# EAGLE design bartoschslomak (EAGLE 9.6.2)
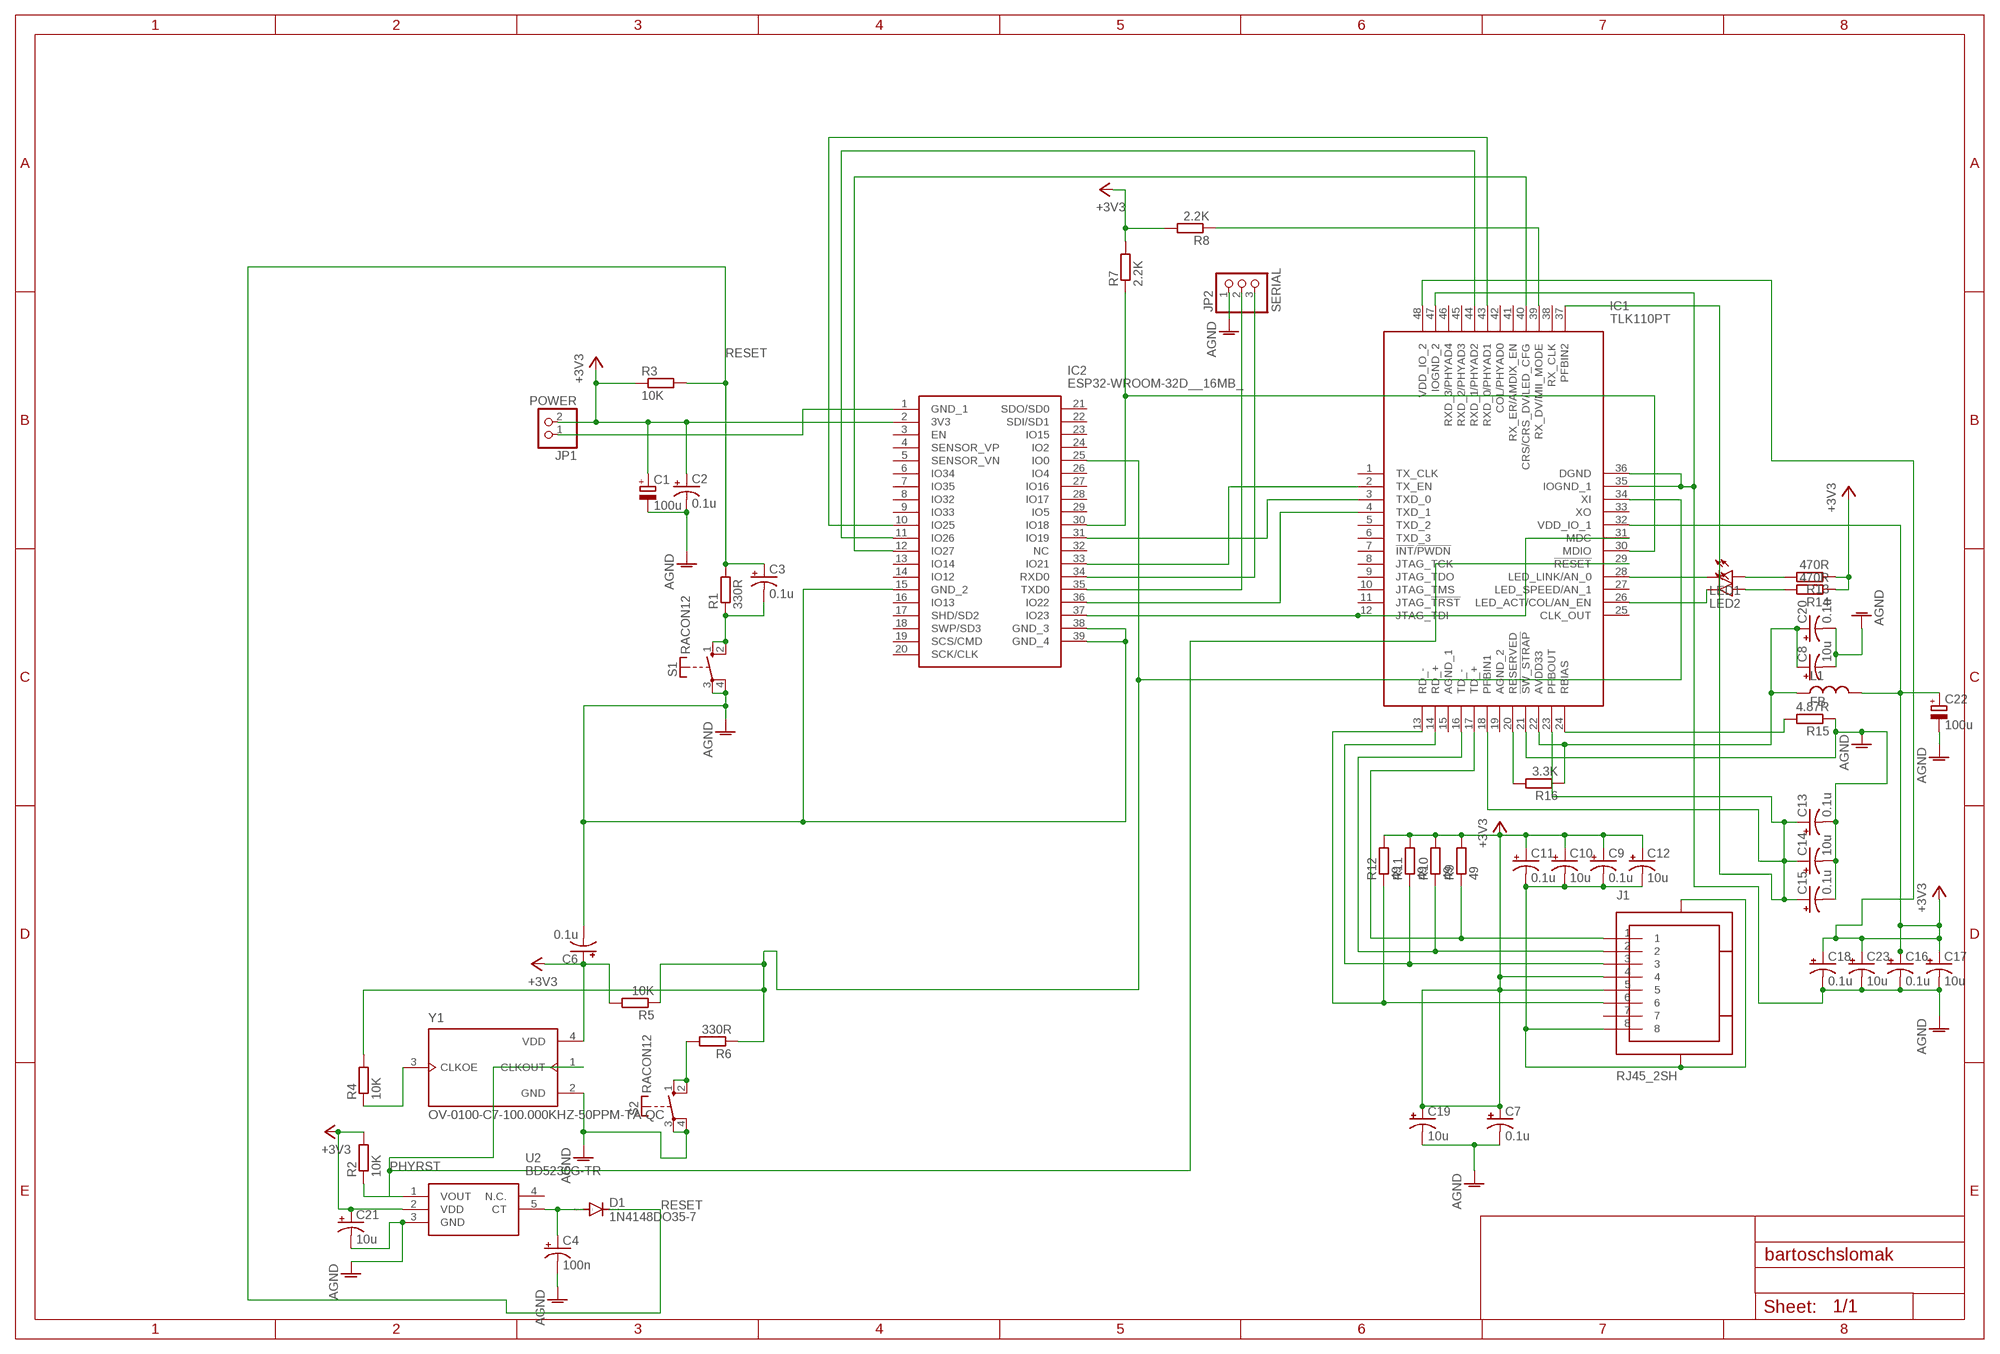
[diagram p0: schematic, sheet 1]

## Parts
C1  100u  CPOL-EUTT2D7  [TT2D7]
C2  0.1u  CPOL-USA/3216-18R  [A/3216-18R]
C3  0.1u  CPOL-USA/3216-18R  [A/3216-18R]
C4  100n  CPOL-USA/3216-18R  [A/3216-18R]
C6  0.1u  CPOL-USA/3216-18R  [A/3216-18R]
C7  0.1u  CPOL-USA/3216-18R  [A/3216-18R]
C8  10u  CPOL-USA/3216-18R  [A/3216-18R]
C9  0.1u  CPOL-USA/3216-18R  [A/3216-18R]
C10  10u  CPOL-USA/3216-18R  [A/3216-18R]
C11  0.1u  CPOL-USA/3216-18R  [A/3216-18R]
C12  10u  CPOL-USA/3216-18R  [A/3216-18R]
C13  0.1u  CPOL-USA/3216-18R  [A/3216-18R]
C14  10u  CPOL-USA/3216-18R  [A/3216-18R]
C15  0.1u  CPOL-USA/3216-18R  [A/3216-18R]
C16  0.1u  CPOL-USA/3216-18R  [A/3216-18R]
C17  10u  CPOL-USA/3216-18R  [A/3216-18R]
C18  0.1u  CPOL-USA/3216-18R  [A/3216-18R]
C19  10u  CPOL-USA/3216-18R  [A/3216-18R]
C20  0.1u  CPOL-USA/3216-18R  [A/3216-18R]
C21  10u  CPOL-USA/3216-18R  [A/3216-18R]
C22  100u  CPOL-EUTT2D7  [TT2D7]
C23  10u  CPOL-USA/3216-18R  [A/3216-18R]
D1  1N4148DO35-7  [DO35-7]
IC1  TLK110PT  [QFP50P900X900X160-48N]
IC2  ESP32-WROOM-32D__16MB_  [ESP32WROOM32D16MB]
J1  RJ45_2SH  [RJ45_LP_RA_SMT]
JP1  POWER  PINHD-1X2  [1X02]
JP2  SERIAL  PINHD-1X3  [1X03]
L1  FB  L  (no package)
LED1  LED  [SMARTLED-TTW]
LED2  LED  [SMARTLED-TTW]
R1  330R  R-EU_01005  [R01005]
R2  10K  R-EU_01005  [R01005]
R3  10K  R-EU_01005  [R01005]
R4  10K  R-EU_01005  [R01005]
R5  10K  R-EU_01005  [R01005]
R6  330R  R-EU_01005  [R01005]
R7  2.2K  R-EU_01005  [R01005]
R8  2.2K  R-EU_01005  [R01005]
R9  49  R-EU_01005  [R01005]
R10  49  R-EU_01005  [R01005]
R11  49  R-EU_01005  [R01005]
R12  49  R-EU_01005  [R01005]
R13  470R  R-EU_01005  [R01005]
R14  470R  R-EU_01005  [R01005]
R15  4.87R  R-EU_01005  [R01005]
R16  3.3K  R-EU_01005  [R01005]
S1  RACON12  [RACON12]
S2  RACON12  [RACON12]
U2  BD5230G-TR  [SOT95P280X125-5N]
Y1  OV-0100-C7-100.000KHZ-50PPM-TA-QC  [OSC_OV-0100-C7-100.000KHZ-50PPM-TA-QC]

## Nets
+3V1: C13.+ C14.+ C15.+ IC1.18(PFBIN1) IC1.23(PFBOUT) IC1.37(PFBIN2)
+3V3 [3V3]: C1.+ C2.+ C6.+ C7.+ C9.+ C10.+ C11.+ C12.+ C16.+ C17.+ C18.+ C19.+ C21.+ C22.+ C23.+ IC1.32(VDD_IO_1) IC1.48(VDD_IO_2) IC2.2(3V3) J1.4 J1.5 JP1.2 L1.2 R2.2 R3.1 R5.2 R7.2 R8.2 R9.2 R10.2 R11.2 R12.2 R13.1 R14.1 U2.2(VDD) Y1.4(VDD)
AGND [GND]: C1.- C2.- C4.- C6.- C7.- C8.- C13.- C14.- C15.- C16.- C17.- C18.- C19.- C20.- C21.- C22.- C23.- IC1.21(!SW_STRAP) IC1.35(IOGND_1) IC1.36(DGND) IC1.47(IOGND_2) IC2.15(GND_2) IC2.38(GND_3) IC2.39(GND_4) JP2.1 R15.1 S1.3(P) S1.4(P) S2.3(P) S2.4(P) U2.3(GND) Y1.2(GND)
N$2: IC2.1(GND_1) JP1.1
N$3: R4.1 Y1.3(CLKOE)
N$4: C3.- R1.1 S1.1(S) S1.2(S)
N$5: IC1.34(XI) IC2.25(IO0) R4.2 R5.1 R6.1
N$6: IC2.34(RXD0) JP2.3
N$7: R6.2 S2.1(S) S2.2(S)
N$8: IC2.35(TXD0) JP2.2
N$9: C4.+ D1.A U2.5(CT)
N$10: IC1.12(JTAG_TDI) IC1.31(MDC) IC2.37(IO23)
N$11: IC1.43(RXD_0/PHYAD1) IC2.10(IO25)
N$12: IC1.44(RXD_1/PHYAD2) IC2.11(IO26)
N$13: IC1.40(CRS/CRS_DV/LED_CFG) IC2.12(IO27)
N$14: IC1.4(TXD_1) IC2.36(IO22)
N$15: IC1.2(TX_EN) IC2.33(IO21)
N$16: IC1.3(TXD_0) IC2.31(IO19)
N$17: IC1.30(MDIO) IC2.30(IO18) R7.1
N$18: IC1.24(RBIAS) R15.2
N$19: IC1.39(RX_DV/MII_MODE) R8.1
N$20: C9.- C10.- C11.- C12.- J1.8 J1.S$1(SHIELD) J1.S$2(SHIELD)
N$21: IC1.20(RESERVED) R16.2
N$24: IC1.17(TD_+) J1.1 R9.1
N$25: IC1.16(TD_-) J1.2 R10.1
N$26: IC1.14(RD_+) J1.3 R11.1
N$27: IC1.13(RD_-) J1.6 R12.1
N$29: C8.+ C20.+ IC1.22(AVDD33) L1.1 R16.1
N$31: IC1.26(LED_ACT/COL/AN_EN) LED2.C@1(C)
N$32: IC1.28(LED_LINK/AN_0) LED1.C@1(C)
N$33: LED1.A@1(A) R13.2
N$34: LED2.A@1(A) R14.2
PHYRST: IC1.29(!RESET) R2.1 U2.1(VOUT) Y1.1(CLKOUT)
RESET: C3.+ D1.C R1.2 R3.2
Unconnected: IC1.1(TX_CLK) IC1.5(TXD_2) IC1.6(TXD_3) IC1.7(!INT!/!PWDN) IC1.8(JTAG_TCK) IC1.9(JTAG_TDO) IC1.10(JTAG_TMS) IC1.11(JTAG_!TRST) IC1.15(AGND_1) IC1.19(AGND_2) IC1.25(CLK_OUT) IC1.27(LED_SPEED/AN_1) IC1.33(XO) IC1.38(RX_CLK) IC1.41(RX_ER/AMDIX_EN) IC1.42(COL/PHYAD0) IC1.45(RXD_2/PHYAD3) IC1.46(RXD_3/PHYAD4) IC2.3(EN) IC2.4(SENSOR_VP) IC2.5(SENSOR_VN) IC2.6(IO34) IC2.7(IO35) IC2.8(IO32) IC2.9(IO33) IC2.13(IO14) IC2.14(IO12) IC2.16(IO13) IC2.17(SHD/SD2) IC2.18(SWP/SD3) IC2.19(SCS/CMD) IC2.20(SCK/CLK) IC2.21(SDO/SD0) IC2.22(SDI/SD1) IC2.23(IO15) IC2.24(IO2) IC2.26(IO4) IC2.27(IO16) IC2.28(IO17) IC2.29(IO5) IC2.32(NC) J1.7 U2.4(N.C.)

## Library data of the parts
C1 C22 = rcl:CPOL-EU: POLARIZED CAPACITOR, European symbol; SPICEPREFIX: C
C2-C4 C6-C21 C23 = rcl:CPOL-US: POLARIZED CAPACITOR, American symbol; SPICEPREFIX: C
D1 = diode:1N4148: DIODE high speed (Philips)
IC1 = TLK110PT:TLK110PT: Texas Instruments TLK110PT Ethernet Transceiver, IEEE 802.3u, 10 Mbit/s, 100 Mbit/s 3.3 V, 48-Pin LQFP Source: Datasheet <http://www.ti.com/lit/gpn/tlk110>; ARROW_PART_NUMBER: TLK110PT; ARROW_PRICE-STOCK: https://www.arrow.com/en/products/tlk110pt/texas-instruments; DESCRIPTION: Texas Instruments TLK110PT Ethernet Transceiver, IEEE 802.3u, 10 Mbit/s, 100 Mbit/s 3.3 V, 48-Pin LQFP; HEIGHT: 1.6mm; MANUFACTURER_NAME: Texas Instruments; MANUFACTURER_PART_NUMBER: TLK110PT; MOUSER_PART_NUMBER: 595-TLK110PT; MOUSER_PRICE-STOCK: https://www.mouser.com/Search/Refine.aspx?Keyword=595-TLK110PT
IC2 = ESP32-WROOM-32D__16MB_:ESP32-WROOM-32D__16MB_: WiFi Modules (802.11) SMD Module, ESP32-D0WD, 128Mbits SPI flash, UART mode, PCB antenna Source: Datasheet <https://www.espressif.com/sites/default/files/documentation/esp32-wroom-32d_esp32-wroom-32u_datasheet_en.pdf>; DESCRIPTION: WiFi Modules (802.11) SMD Module, ESP32-D0WD, 128Mbits SPI flash, UART mode, PCB antenna; HEIGHT: 3.2mm; MANUFACTURER_NAME: Espressif Systems; MANUFACTURER_PART_NUMBER: ESP32-WROOM-32D (16MB); MOUSER_PART_NUMBER: 356-ES32WROOM32D16MB
J1 = TL-WR703N:RJ45_2SH: RJ45 Socket with 2 Shield Pins Copyright © 2012, Michel Stempin, All rights reserved Licenced under Creative Commons CC BY-SA 3.0 <http://creativecommons.org/licenses/by-sa/3.0/deed.en> license.
JP1 = pinhead:PINHD-1X2: PIN HEADER
JP2 = pinhead:PINHD-1X3: PIN HEADER
L1 = ngspice-simulation:L: INDUCTOR
LED1 LED2 = led:LED: LED OSRAM: - CHIPLED LG R971, LG N971, LY N971, LG Q971, LY Q971, LO R971, LY R971 LH N974, LH R974 LS Q976, LO Q976, LY Q976 LO Q996 - Hyper CHIPLED LW Q18S LB Q993, LB Q99A, LB R99A - SideLED LS A670, LO A670, LY A670, LG A670, LP A670 LB A673, LV A673, LT A673, LW A673 LH A674 LY A675 LS A676, LA A676, LO A676, LY A676, LW A676 LS A679, LY A679, LG A679 - Hyper Micro SIDELED® LS Y876, LA Y876, LO Y876, LY Y876 LT Y87S - SmartLED LW L88C, LW L88S LB L89C, LB L89S, LG L890 LS L89K, LO L89K, LY L89K LS L896, LA L896, LO L896, LY L896 - TOPLED LS T670, LO T670, LY T670, LG T670, LP T670 LSG T670, LSP T670, LSY T670, LOP T670, LYG T670 LG T671, LOG T671, LSG T671 LB T673, LV T673, LT T673, LW T673 LH T674 LS T676, LA T676, LO T676, LY T676, LB T676, LH T676, LSB T676, LW T676 LB T67C, LV T67C, LT T67C, LS T67K, LO T67K, LY T67K, LW E67C LS E67B, LA E67B, LO E67B, LY E67B, LB E67C, LV E67C, LT E67C LW T67C LS T679, LY T679, LG T679 LS T770, LO T770, LY T770, LG T770, LP T770 LB T773, LV T773, LT T773, LW T773 LH T774 LS E675, LA E675, LY E675, LS T675 LS T776, LA T776, LO T776, LY T776, LB T776 LHGB T686 LT T68C, LB T68C - Hyper Mini TOPLED® LB M676 - Mini TOPLED Santana® LG M470 LS M47K, LO M47K, LY M47K Source: http://www.osram.convergy.de LUXEON: - LUMILED® LXK2-PW12-R00, LXK2-PW12-S00, LXK2-PW14-U00, LXK2-PW14-V00 LXK2-PM12-R00, LXK2-PM12-S00, LXK2-PM14-U00 LXK2-PE12-Q00, LXK2-PE12-R00, LXK2-PE12-S00, LXK2-PE14-T00, LXK2-PE14-U00 LXK2-PB12-K00, LXK2-PB12-L00, LXK2-PB12-M00, LXK2-PB14-N00, LXK2-PB14-P00, LXK2-PB14-Q00 LXK2-PR12-L00, LXK2-PR12-M00, LXK2-PR14-Q00, LXK2-PR14-R00 LXK2-PD12-Q00, LXK2-PD12-R00, LXK2-PD12-S00 LXK2-PH12-R00, LXK2-PH12-S00 LXK2-PL12-P00, LXK2-PL12-Q00, LXK2-PL12-R00 Source: www.luxeon.com KINGBRIGHT: KA-3528ASYC Source: www.kingbright.com
R1-R16 = rcl:R-EU_: RESISTOR, European symbol; SPICEPREFIX: R
S1 S2 = switch-misc:RACON12: ITT SWITCH
U2 = BD5230G-TR:BD5230G-TR: ROHM BD5230G-TR, Voltage Detector, 2.3 6 V 5-Pin, SSOP Source: Datasheet <http://rohmfs.rohm.com/en/products/databook/datasheet/ic/power/voltage_detector/bd52xxg-e.pdf>; DESCRIPTION: ROHM BD5230G-TR, Voltage Detector, 2.3 6 V 5-Pin, SSOP; HEIGHT: 1.25mm; MANUFACTURER_NAME: ROHM Semiconductor; MANUFACTURER_PART_NUMBER: BD5230G-TR; MOUSER_PART_NUMBER: 755-BD5230G-TR; MOUSER_PRICE-STOCK: https://www.mouser.co.uk/ProductDetail/ROHM-Semiconductor/BD5230G-TR?qs=4kLU8WoGk0s1B3xxWJut5A%3D%3D
Y1 = OV-0100-C7-100.000KHZ-50PPM-TA-QC:OV-0100-C7-100.000KHZ-50PPM-TA-QC: OV-0100-C7-32.768KHZ-20PPM-TB-QC Low Power Clock Oscillator 100.000 kHz Check availability <https://pricing.snapeda.com/parts/OV-0100-C7-100.000KHZ-50PPM-TA-QC/Micro%20Crystal/view-part?ref=eda>; AVAILABILITY: In Stock; CHECK_PRICES: https://www.snapeda.com/parts/OV-0100-C7-100.000KHZ-50PPM-TA-QC/Micro+Crystal/view-part/?ref=eda; DESCRIPTION: 100 kHz XO (Standard) CMOS Oscillator 3V Enable/Disable 4-SMD, No Lead; MF: Micro Crystal; MP: OV-0100-C7-100.000KHZ-50PPM-TA-QC; PACKAGE: QFN-4 Micro Crystal; PRICE: None; PURCHASE-URL: https://www.snapeda.com/api/url_track_click_mouser/?unipart_id=13796273&manufacturer=Micro Crystal&part_name=OV-0100-C7-100.000KHZ-50PPM-TA-QC&search_term=kc7050a; SNAPEDA_LINK: https://www.snapeda.com/parts/OV-0100-C7-100.000KHZ-50PPM-TA-QC/Micro+Crystal/view-part/?ref=snap

## Net classes
0 default: width 0.127 mm, drill 0.127 mm, clearance 0.127 mm
1 RESET: width 0.127 mm, drill 0.127 mm, clearance 0.127 mm
2 3V3: width 0.203 mm, drill 0.127 mm, clearance 0.127 mm
3 GND: width 0.127 mm, drill 0.127 mm, clearance 0.127 mm

## Board
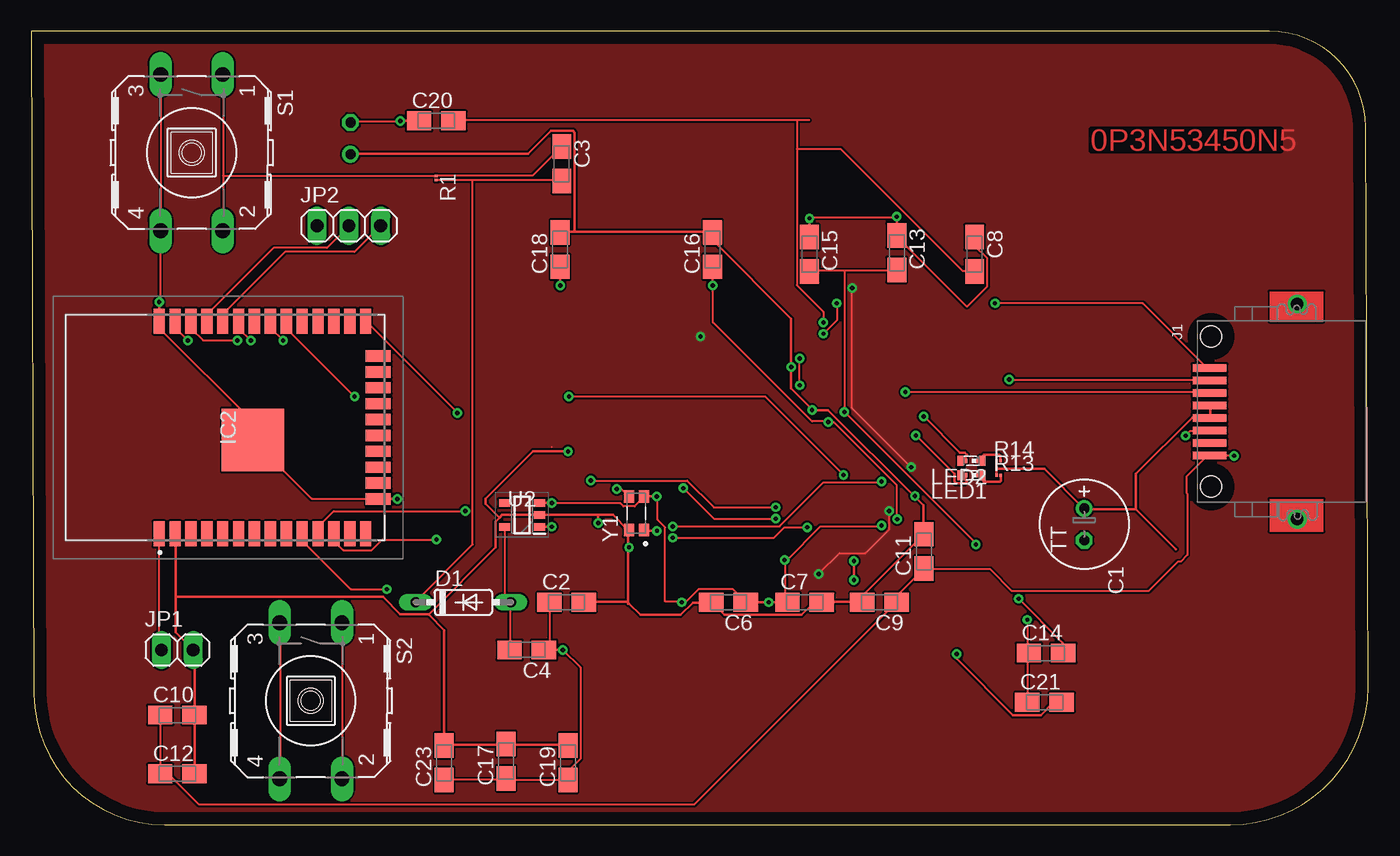
[diagram p1: board, top side]
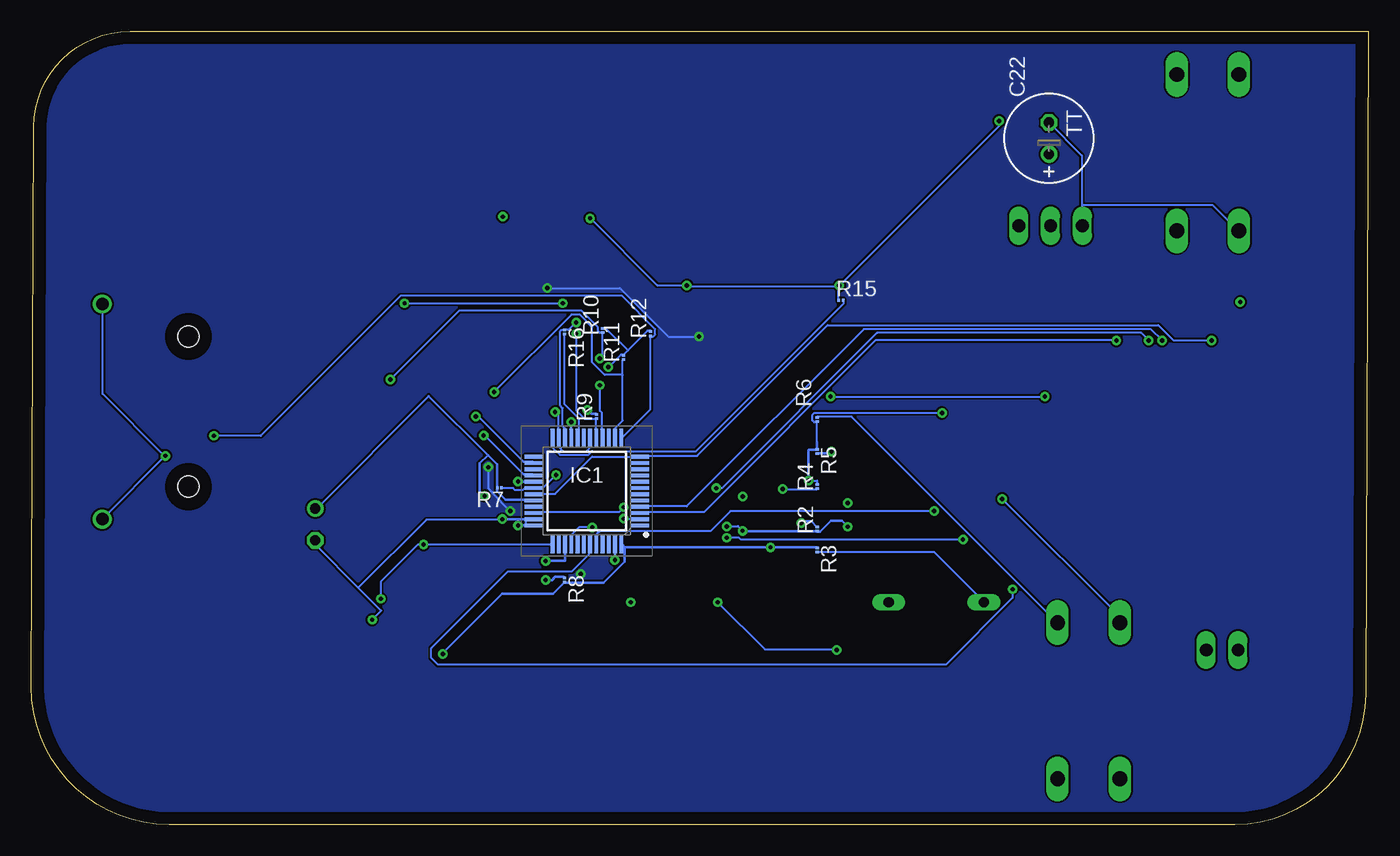
[diagram p2: board, bottom side, seen from below]

Size 106.91 x 63.42 mm. Coordinates in mm from the lower left corner, seen from the top.
Outline: 0,63.42 0.21,10.42 arc90 10.67,0 95.89,0 arc90 106.91,11.02 106.7,55.78 arc90 99.02,63.42 0,63.42
Copper layers (1*16): Top 0.035mm / dielectric 1.5mm / Bottom 0.035mm
Design rules "default": minimum track width 6mil, minimum drill 0.35mm, track to track 6mil, track to pad 6mil, pad to pad 6mil, via to via 6mil, smd to smd 6mil, copper to edge 40mil, drill to drill 6mil, minimum pad ring 10mil, minimum via ring 8mil, stop-mask expansion 4mil, vias tented up to drill 0mil, thermal gap 10mil

### Footprints (pad centres in the part's own frame; a part is rotated, then mirrored left to right if it is on the bottom)
TT2D7 = drill 0.813: + -1.27,0 | drill 0.813 octagon: - 1.27,0
A/3216-18R = smd 1.95 x 1.5: + 1.375,0; - -1.375,0
DO35-7 = drill 0.813 long: A 3.81,0; C -3.81,0
QFP50P900X900X160-48N = smd 1.475 x 0.3: 1 -4.238,2.75; 2 -4.238,2.25; 3 -4.238,1.75; 4 -4.238,1.25; 5 -4.238,0.75; 6 -4.238,0.25; 7 -4.238,-0.25; 8 -4.238,-0.75; 9 -4.238,-1.25; 10 -4.238,-1.75; 11 -4.238,-2.25; 12 -4.238,-2.75; 25 4.238,-2.75; 26 4.238,-2.25; 27 4.238,-1.75; 28 4.238,-1.25; 29 4.238,-0.75; 30 4.238,-0.25; 31 4.238,0.25; 32 4.238,0.75; 33 4.238,1.25; 34 4.238,1.75; 35 4.238,2.25; 36 4.238,2.75 | smd 0.3 x 1.475: 13 -2.75,-4.238; 14 -2.25,-4.238; 15 -1.75,-4.238; 16 -1.25,-4.238; 17 -0.75,-4.238; 18 -0.25,-4.238; 19 0.25,-4.238; 20 0.75,-4.238; 21 1.25,-4.238; 22 1.75,-4.238; 23 2.25,-4.238; 24 2.75,-4.238; 37 2.75,4.238; 38 2.25,4.238; 39 1.75,4.238; 40 1.25,4.238; 41 0.75,4.238; 42 0.25,4.238; 43 -0.25,4.238; 44 -0.75,4.238; 45 -1.25,4.238; 46 -1.75,4.238; 47 -2.25,4.238; 48 -2.75,4.238
ESP32WROOM32D16MB = smd 2 x 0.9: 1 -8.5,5.26; 2 -8.5,3.99; 3 -8.5,2.72; 4 -8.5,1.45; 5 -8.5,0.18; 6 -8.5,-1.09; 7 -8.5,-2.36; 8 -8.5,-3.63; 9 -8.5,-4.9; 10 -8.5,-6.17; 11 -8.5,-7.44; 12 -8.5,-8.71; 13 -8.5,-9.98; 14 -8.5,-11.25; 25 8.5,-11.25; 26 8.5,-9.98; 27 8.5,-8.71; 28 8.5,-7.44; 29 8.5,-6.17; 30 8.5,-4.9; 31 8.5,-3.63; 32 8.5,-2.36; 33 8.5,-1.09; 34 8.5,0.18; 35 8.5,1.45; 36 8.5,2.72; 37 8.5,3.99; 38 8.5,5.26 | smd 0.9 x 2: 15 -5.715,-12.25; 16 -4.445,-12.25; 17 -3.175,-12.25; 18 -1.905,-12.25; 19 -0.635,-12.25; 20 0.635,-12.25; 21 1.905,-12.25; 22 3.175,-12.25; 23 4.445,-12.25; 24 5.715,-12.25 | smd 5 x 5: 39 -1,-2.24
RJ45_LP_RA_SMT = smd 0.6 x 2.7: 1 -3.5,0; 2 -2.5,0; 3 -1.5,0; 4 -0.5,0; 5 0.5,0; 6 1.5,0; 7 2.5,0; 8 3.5,0 | drill 1: S$1 -8.6,7; S$2 8.6,7 | hole 1.7: -6,0.1; 6,0.1
1X02 = drill 1.016 long: 1 -1.27,0; 2 1.27,0
1X03 = drill 1.016 long: 1 -2.54,0; 2 0,0; 3 2.54,0
SMARTLED-TTW = smd 0.8 x 0.5: A 0,-0.875; C 0,0.875 | smd 0.35 x 0.35: A@1 0,-0.5; C@1 0,0.5
R01005 = smd 0.2 x 0.25: 1 -0.163,0; 2 0.163,0
RACON12 = drill 1.194 long: 1 -6.248,2.489; 2 6.248,2.489; 3 -6.248,-2.489; 4 6.248,-2.489
SOT95P280X125-5N = smd 0.9 x 0.6: 1 -1.4,0.95; 2 -1.4,0; 3 -1.4,-0.95; 4 1.4,-0.95; 5 1.4,0.95
OSC_OV-0100-C7-100.000KHZ-50PPM-TA-QC = smd 1 x 0.8: 1 -1.35,-0.6; 2 1.35,-0.6; 3 1.35,0.6; 4 -1.35,0.6

### Placement (x,y rotation side)
C1  84.2,24 270 top
C2  42.8,17.78 0 top
C3  42.42,52.83 270 top
C4  39.62,13.97 180 top
C6  55.75,17.78 180 top
C7  61.85,17.78 0 top
C8  75.44,45.59 270 top
C9  67.82,17.78 180 top
C10  11.68,8.76 0 top
C11  71.37,21.84 90 top
C12  11.68,4.06 0 top
C13  69.22,45.72 270 top
C14  81.15,13.72 0 top
C15  62.23,45.59 270 top
C16  54.48,45.97 90 top
C17  37.97,5.08 90 top
C18  42.29,45.97 90 top
C19  42.93,4.95 90 top
C20  32.39,56.26 0 top
C21  81.03,9.78 0 top
C22  25.53,54.86 90 bottom
C23  33.02,4.95 90 top
D1  34.54,17.78 0 top
IC1  62.48,26.67 180 bottom
IC2  15.49,31.75 90 top
J1  94.23,33.02 270 top
JP1  11.68,13.97 0 top
JP2  25.4,47.88 0 top
LED1  75.18,27.94 90 top
LED2  75.18,29.08 90 top
R1  32.39,51.69 270 top
R2  44.07,23.62 90 bottom
R3  44.07,21.97 270 bottom
R4  44.07,27.05 90 bottom
R5  44.07,29.85 270 bottom
R6  44.07,32.39 90 bottom
R7  69.47,26.92 180 bottom
R8  64.26,19.56 270 bottom
R9  61.72,32.64 90 bottom
R10  61.21,39.5 90 bottom
R11  59.56,37.34 90 bottom
R12  57.4,39.24 90 bottom
R13  77.34,27.94 0 top
R14  77.34,29.08 0 top
R15  42.16,41.91 0 bottom
R16  64.26,39.37 270 bottom
S1  12.83,53.72 270 top
S2  22.35,9.91 270 top
U2  39.24,24.76 180 top
Y1  48.39,24.89 90 top

### Tracks (layer width: path | path; a pad name or v marks a point on that pad's centre or on a via)
+3V1  (via drill 0.35)
  Top 0.152: 65.02,44.27 69.22,44.27 C13.+ | 65.02,44.27 62.28,44.27 C15.+ | 65.02,44.27 v65.02,33 75.58,22.44 v75.54,22.4 | v78.97,18.06 82.47,14.55 82.47,13.72 C14.+
  Bottom 0.152: IC1.37 65.25,22.4 v75.54,22.4 76,22.4 78.97,19.43 v78.97,18.06 | IC1.18 62.28,30.86 62.28,30.1 62.51,29.87 64.41,29.87 64.72,30.18 64.72,30.86 IC1.23 64.8,30.94 64.8,32.77 v65.02,33
+3V3  (via drill 0.35)
  Top 0.203: J1.4 94.29,33.45 94.29,32.54 J1.5 94.13,32.54 92.84,32.54 88.34,28.04 88.34,25.22 | 88.34,25.22 84.23,25.22 | 91.54,22.02 88.34,25.22 | 84.23,25.22 C1.+ | 43.46,47.4 54.43,47.4 C16.+ 54.59,47.32 54.59,46.63 60.76,40.46 v60.76,36.58 60.76,34.9 62.43,33.22 v62.43,33.15 63.73,33.15 70.62,26.25 | 43.46,47.4 42.32,47.4 C18.+ | 43.46,47.4 43.46,55.32 43.31,55.47 41.55,55.47 39.73,53.64 25.55,53.64 C22.+ | 70.62,26.25 71.35,25.53 71.35,23.24 C11.+ 71.35,23.17 66.4,18.21 66.4,17.91 C9.+ 66.4,17.83 63.27,17.83 C7.+ 63.2,17.68 62.51,17.68 61.59,16.76 55.42,16.76 54.43,17.75 C6.+ 54.36,17.75 52.91,17.75 51.92,16.76 48.72,16.76 47.8,17.68 47.73,17.68 47.73,17.83 | 11.53,18.21 11.53,15.39 JP1.2 13.06,13.87 13.06,8.84 C10.+ 13.06,4.11 C12.+ | 11.53,18.21 11.53,23.24 IC2.2 | 45.34,24.76 46.51,24.76 47.73,23.55 Y1.4 47.73,23.47 47.73,22.17 | 45.34,24.76 U2.2 37.67,24.76 37.44,24.54 | 47.73,17.83 44.22,17.83 C2.+ | 47.73,17.83 47.73,22.17 | 11.53,18.21 28.14,18.21 29.52,16.84 31.8,16.84 | 31.8,16.84 37.14,22.17 37.14,24.23 37.44,24.54 | v47.8,22.17 47.73,22.17 | R14.1 77.18,28.45 | 77.18,28.45 R13.1 | 77.18,28.45 81,28.45 84.23,25.22 | v45.34,24.13 45.34,24.76 | 37.44,24.54 36.32,25.65 36.32,26.04 40.13,29.85 v42.93,29.85 | v70.66,26.29 70.62,26.25 | C19.+ 42.93,6.4 38.05,6.4 C17.+ 37.97,6.4 33.02,6.4 C23.+ 33.02,15.54 31.8,16.76 31.8,16.84 | v74.02,13.64 74.02,13.26 78.51,8.76 80.72,8.76 81.71,9.75 82.4,9.75 C21.+
  Bottom 0.203: IC1.32 66.78,25.98 68.99,25.98 69.67,26.67 69.67,26.9 R7.2 69.67,26.97 69.67,28.8 70.4,29.53 | 70.4,29.53 75.12,34.25 84.15,25.22 C1.+ | 59.46,22.17 v47.8,22.17 44.07,22.17 R3.1 | 59.46,22.17 59.69,22.4 IC1.48 | 59.46,22.17 59.46,21.03 61.14,19.36 64.26,19.36 R8.2 65.19,18.47 69.27,18.47 74.02,13.72 v74.02,13.64 | 59.2,37.91 57.63,39.47 57.4,39.47 R12.2 | 59.2,37.91 59.54,37.57 R11.2 59.61,37.57 59.77,37.57 v60.76,36.58 | 59.2,37.91 60.98,39.7 61.21,39.7 R10.2 | v62.43,33.15 62.13,32.84 61.75,32.84 R9.2 | R2.2 44.54,24.26 45.21,24.26 v45.34,24.13 | R5.2 43.09,29.68 v42.93,29.85 | 70.4,29.53 71.04,28.88 71.04,26.67 v70.66,26.29
AGND  (via drill 0.35, 0.35 pad 0.55)
  Top 0.152: S2.4 19.91,3.66 19.91,16.15 S2.3 | IC2.15 27.69,26.06 22.43,26.06 17.78,30.71 IC2.39 17.7,30.79 17.7,32.23 10.24,39.7 10.24,40.16 IC2.38 | C22.- 25.63,56.24 29.44,56.24 v29.5,56.26 | v10.23,41.78 10.31,41.83 10.31,47.47 S1.4 10.39,47.47 10.39,59.97 S1.3 | 62.28,48.54 v62.23,48.47 62.36,48.54 69.14,48.54 v69.22,48.6 | C13.- 69.22,47.02 74.82,41.42 76.45,43.05 76.45,45.26 75.46,46.25 75.46,46.94 C8.- | v41.62,25.71 41.71,25.68 47.12,25.68 47.35,25.45 48.26,25.45 49.02,26.21 Y1.2 | C2.- 41.48,17.75 41.48,14.02 C4.- | C7.- 60.3,17.83 60.3,21.11 v60.23,21.16 60.38,21.11 63.12,23.85 67.92,23.85 v67.99,23.92 | v58.97,17.78 58.93,17.83 58.7,17.83 58.63,17.78 | v69.24,24.42 69.22,24.46 69.22,27.13 64.19,32.16 63.81,32.16 v63.73,32.18 63.73,32.23 62.43,32.23 54.51,40.16 54.51,43.05 v54.48,43.09 | C6.- 57.1,17.83 56.11,18.82 53.36,18.82 52.38,17.83 52.07,17.83 v52.03,17.78 51.99,17.83 50.7,17.83 50.7,23.77 50.09,24.38 50.09,26.21 v50.02,26.24 | C23.- 37.9,3.58 37.97,3.66 C17.- 37.97,3.58 C19.- | C21.- 79.65,9.83 79.65,13.64 79.73,13.72 C14.- 79.65,13.72 v79.65,16.38 | C19.- 42.93,4.27 43.92,5.26 43.92,12.57 42.55,13.94 v42.5,13.97 | C19.-
  Top 0.203: C15.- v62.23,48.47 | C4.- v42.5,13.97 | C20.- v29.5,56.26 | C13.- v69.22,48.6 | IC2.15 v29.28,26.04 | IC2.38 v10.23,41.78 | C6.- 58.63,17.78 | U2.3 v41.62,25.71 | C7.- v58.97,17.78 | C18.- v42.29,43.09 | C16.- v54.48,43.09 | Y1.2 v50.02,26.24
  Bottom 0.152: 22.89,49.53 22.89,53.49 C22.- | 22.89,49.53 22.89,47.93 JP2.1 | 22.89,49.53 12.45,49.53 10.39,47.47 S1.4 | S2.3 19.91,16.15 19.91,16.69 29.21,25.98 v29.28,26.04 | R15.1 42.39,41.91 42.39,42.98 42.32,43.05 v42.29,43.09 | v42.29,43.09 42.39,43.05 54.43,43.05 v54.48,43.09 54.51,43.13 56.87,43.13 62.2,48.46 v62.23,48.47 | 80.76,18.94 78.93,17.11 v79.65,16.38 | 80.76,18.94 84.15,22.33 84.15,22.71 C1.- | IC1.36 67.39,24 67.39,24.38 IC1.35 | v42.5,13.97 42.55,14.02 48.26,14.02 51.99,17.75 v52.03,17.78 | 80.76,18.94 75.31,24.38 69.29,24.38 v69.24,24.42 | v29.5,56.26 29.52,56.24 29.52,55.86 42.24,43.13 v42.29,43.09
  Bottom 0.203: IC1.36 v67.99,23.92 | IC1.35 v69.24,24.42 | IC1.47 v60.23,21.16 | IC1.21 v63.73,32.18
GND  (via drill 0.35)
  Top 0.152: 41.63,30.18 41.63,30.2 | v65.63,42.9 65.63,33.3 v70.36,28.57 | v68.61,25.07 68.61,23.62 66.7,21.72 64.64,21.72 v62.97,20.04
  Bottom 0.152: v53.52,39.01 55.96,39.01 59.84,42.9 v65.63,42.9 | v70.36,28.57 70.36,26.9 70.05,26.59 70.05,26.52 v68.61,25.07
  pour Top: -0.76,0.13 1.14,-1.78 109.35,-1.78 109.35,57.91 102.87,64.39 0.38,64.39
  pour Bottom: -0.76,65.66 -0.76,0.13 1.14,-1.78 109.35,-1.78 109.35,57.91 102.87,64.39
N$2
  Top 0.152: IC2.1 10.24,14.17 10.39,14.02 JP1.1
N$3  (via drill 0.35)
  Top 0.152: v46.81,26.82 47.19,26.82 47.73,26.29 Y1.3
  Bottom 0.152: v46.81,26.82 44.07,26.82 R4.1
N$4
  Top 0.152: C3.- 42.39,54.18 40.11,51.89 32.41,51.89 R1.1 32.33,51.89 15.34,51.89 | 15.34,51.89 15.34,59.97 S1.1 | 15.34,51.89 15.34,47.47 S1.2
N$5  (via drill 0.35)
  Top 0.152: v59.54,25.37 54.59,25.37 52.45,27.51 v44.75,27.51 | v34.09,32.92 26.77,40.23 IC2.25
  Bottom 0.152: R4.2 44.07,27.51 v44.75,27.51 | 44.07,30.56 44.07,32.16 | v59.54,25.37 59.92,24.99 66.7,24.99 IC1.34 | v34.09,32.92 44.3,32.92 44.45,32.77 44.45,32.31 44.3,32.16 44.07,32.16 | 44.07,32.16 R6.1
  Bottom 0.203: 44.07,30.56 R5.1 44.11,29.97 44.7,29.97 44.75,29.92 v44.75,27.51
N$6
  Top 0.152: JP2.3 25.86,45.8 20.3,45.8 15.34,40.84 15.34,40.31 IC2.34
N$7
  Top 0.152: S2.2 24.87,3.66 24.87,16.15 S2.1
  Bottom 0.152: R6.2 44.07,32.61 41.33,32.61 24.87,16.15 S2.1
N$8
  Top 0.152: IC2.35 14.05,40.31 14.05,40.77 19.38,46.1 23.65,46.1 25.4,47.85 JP2.2
N$9
  Top 0.152: U2.5 37.9,23.77 37.9,18.29 38.35,17.83 D1.A 38.28,17.83 38.28,14.02 C4.+
N$10  (via drill 0.35)
  Top 0.152: v12.52,38.71 11.53,39.7 11.53,40.23 IC2.37
  Bottom 0.152: IC1.31 66.7,26.44 65.02,26.44 62.05,29.41 58.32,29.41 IC1.12 58.24,29.49 53.67,29.49 43.23,39.93 16.79,39.93 15.57,38.71 v12.52,38.71
N$11  (via drill 0.35)
  Top 0.152: v28.45,18.82 25.55,18.82 21.67,22.71 IC2.10
  Bottom 0.152: v28.45,18.82 28.45,18.14 33.78,12.8 74.4,12.8 74.93,13.33 74.93,14.1 68.78,20.24 63.68,20.24 62.28,21.64 62.28,22.4 IC1.43
N$12  (via drill 0.35)
  Top 0.152: v34.7,25.07 24.18,25.07 22.96,23.85 22.96,23.32 IC2.11
  Bottom 0.152: v34.7,25.07 51,25.07 52.6,23.47 61.44,23.47 61.67,23.24 61.67,22.48 IC1.44
N$13  (via drill 0.35)
  Top 0.152: v62.05,23.77 60.22,23.77 59.39,22.94 v51.31,22.94 | v32.41,22.78 28.07,22.78 27.23,21.95 24.94,21.95 24.26,22.63 24.26,23.24 IC2.12
  Bottom 0.152: v62.05,23.77 63.12,23.77 63.73,23.17 63.73,22.48 IC1.40 | v51.31,22.94 50.32,22.94 50.17,22.78 v32.41,22.78
N$14  (via drill 0.35)
  Top 0.152: v16.48,38.71 13.74,38.71 12.83,39.62 12.83,40.23 IC2.36
  Bottom 0.152: v16.48,38.71 17.4,39.62 40.34,39.62 54.51,25.45 58.24,25.45 IC1.4
N$15  (via drill 0.35)
  Top 0.152: v59.54,24.46 54.59,24.46 v52.15,26.9 | v17.55,38.71 16.64,39.62 16.64,40.23 IC2.33
  Bottom 0.152: v59.54,24.46 58.32,24.46 IC1.2 | v52.15,26.9 51.69,26.9 39.27,39.32 18.16,39.32 v17.55,38.71
N$16  (via drill 0.35)
  Top 0.152: v20.14,38.71 19.15,39.7 19.15,40.23 IC2.31
  Bottom 0.152: v20.14,38.71 39.42,38.71 53.14,24.99 58.24,24.99 IC1.3
N$17  (via drill 0.35)
  Top 0.152: v25.86,34.21 20.45,39.62 20.45,40.23 IC2.30 | v43,34.21 58.7,34.21 v64.95,27.96
  Bottom 0.152: R7.1 69.29,26.9 68.38,26.9 68.22,26.75 67.61,26.75 67.46,26.9 66.78,26.9 IC1.30 66.7,26.97 65.94,26.97 v64.95,27.96 | v43,34.21 v25.86,34.21
N$18
  Bottom 0.152: R15.2 41.94,41.91 41.94,41.68 53.75,29.87 62.05,29.87 62.36,29.57 64.64,29.57 65.18,30.1 65.18,30.86 IC1.24
N$19  (via drill 0.35)
  Top 0.203: v65.79,21.08 v65.79,19.56
  Bottom 0.203: R8.1 64.35,19.81 65.02,19.81 65.28,19.56 v65.79,19.56 | IC1.39 64.23,21.11 64.26,21.08 v65.79,21.08
N$20  (via drill 0.35)
  Top 0.152: C9.- 69.22,17.83 69.22,18.29 71.35,20.42 C11.- 71.42,20.42 76.68,20.42 78.43,18.67 89.33,18.67 91.69,21.03 91.92,21.03 92.46,21.57 92.46,26.44 92.38,26.52 92.38,27.81 94.06,29.49 94.21,29.49 J1.8 94.29,29.49 v96.19,29.49 | 69.22,17.75 C9.- | C10.- 10.31,4.11 C12.- 10.39,4.11 10.92,4.11 13.44,1.6 52.98,1.6 69.14,17.75 C9.-
  Bottom 0.152: J1.S$2 101.22,24.46 v96.19,29.49 96.27,29.49 101.22,34.44 101.22,41.61 J1.S$1
N$21
  Bottom 0.152: R16.2 64.26,33.6 63.12,32.46 63.12,31.01 63.2,30.94 IC1.20
N$24  (via drill 0.35)
  Top 0.152: v63.35,39.24 64.41,40.31 v64.41,41.68 | v77.06,41.68 88.88,41.68 93.98,36.58 94.21,36.58 J1.1
  Bottom 0.152: IC1.17 61.75,30.94 61.75,32.46 R9.1 61.82,32.46 62.66,32.46 63.35,33.15 v63.35,39.24 | v77.06,41.68 v64.41,41.68
N$25  (via drill 0.35)
  Top 0.152: v61.44,35.13 v61.44,37.26 | v78.21,35.58 94.21,35.58 J1.2
  Bottom 0.152: R10.1 61.21,37.49 v61.44,37.26 | v61.44,35.13 61.44,33.07 61.29,32.92 61.29,30.94 IC1.16 | v78.21,35.58 72.72,41.07 62.89,41.07 61.59,39.78 61.59,39.47 61.44,39.32 R10.1 | R10.1
N$26  (via drill 0.35)
  Top 0.152: v69.9,34.59 94.21,34.59 J1.3
  Bottom 0.152: 59.61,35.97 59.61,32.31 60.22,31.7 60.22,30.94 IC1.14 | 59.61,35.97 59.61,37.11 R11.1 | v69.9,34.59 63.73,40.77 63.04,40.77 62.05,39.78 62.05,36.96 61.06,35.97 59.61,35.97
N$27  (via drill 0.35)
  Top 0.152: v92.3,31.09 92.68,31.47 94.21,31.47 J1.6
  Bottom 0.152: 57.4,39.01 57.4,33.22 59.69,30.94 IC1.13 | v92.3,31.09 88.57,31.09 77.37,42.29 59.69,42.29 57.02,39.62 57.02,39.17 57.17,39.01 57.4,39.01 | 57.4,39.01 R12.1
N$29  (via drill 0.35)
  Top 0.152: 62.2,56.31 61.21,56.31 | 61.21,56.31 33.78,56.31 C20.+ | v63.35,40.16 63.35,41 61.21,43.13 61.21,54.03 | 61.21,56.31 61.21,54.03 | 61.21,54.03 64.72,54.03 74.47,44.27 75.39,44.27 C8.+
  Bottom 0.152: 64.26,39.55 64.49,39.55 64.64,39.39 64.64,33.53 64.41,33.3 64.41,31.85 64.26,31.7 64.26,30.94 IC1.22 | 64.26,39.55 63.96,39.55 v63.35,40.16 | 64.26,39.55 R16.1
N$31  (via drill 0.35 pad 0.55)
  Top 0.203: v71.37,32.64 74.28,29.74 74.66,29.74 74.81,29.59 74.68,29.46 LED2.C@1
  Bottom 0.203: IC1.26 66.82,29.02 67.56,29.02 71.19,32.64 v71.37,32.64
N$32  (via drill 0.35 pad 0.55)
  Top 0.203: v70.74,31.11 73.81,28.05 73.81,27.43 73.95,27.29 74.66,27.29 74.81,27.43 74.68,27.56 LED1.C@1
  Bottom 0.203: IC1.28 66.82,28.02 67.56,28.02 70.66,31.11 v70.74,31.11
N$33
  Top 0.152: R13.2 77.52,27.96 77.53,27.94
  Top 0.203: LED1.A@1 76.19,27.43 77.47,27.43 77.53,27.5 77.53,27.94
N$34
  Top 0.203: LED2.A@1 76.19,29.59 77.39,29.59 77.51,29.47 R14.2
PHYRST  (via drill 0.35, 0.35 pad 0.55)
  Top 0.152: v51.31,23.85 59.84,23.85 63.35,27.36 67.92,27.36 v67.99,27.42
  Top 0.203: U2.1 v41.62,23.82 | v50.04,23.5 49.03,23.5 Y1.1
  Bottom 0.152: 42.09,24.31 41.63,23.85 v41.62,23.82 | 44.07,23.42 R2.1 | v51.31,23.85 50.39,23.85
  Bottom 0.203: IC1.29 v67.99,27.42 | 44.07,23.42 44.06,23.43 43.84,23.43 42.96,24.31 42.09,24.31 | 50.39,23.85 v50.04,23.5 50,23.46 R2.1
RESET
  Top 0.152: 35.31,51.51 42.39,51.51 C3.+ | 35.31,51.51 32.41,51.51 R1.2 | 35.31,51.51 35.31,22.4 30.73,17.83 D1.C
  Bottom 0.152: R3.2 44.07,21.79 34.7,21.79 30.73,17.83 D1.C

### Text on the board
Top: 0P3N53450N5